# EAGLE schematic PickupDaughterBoard (EAGLE 7.4.0)
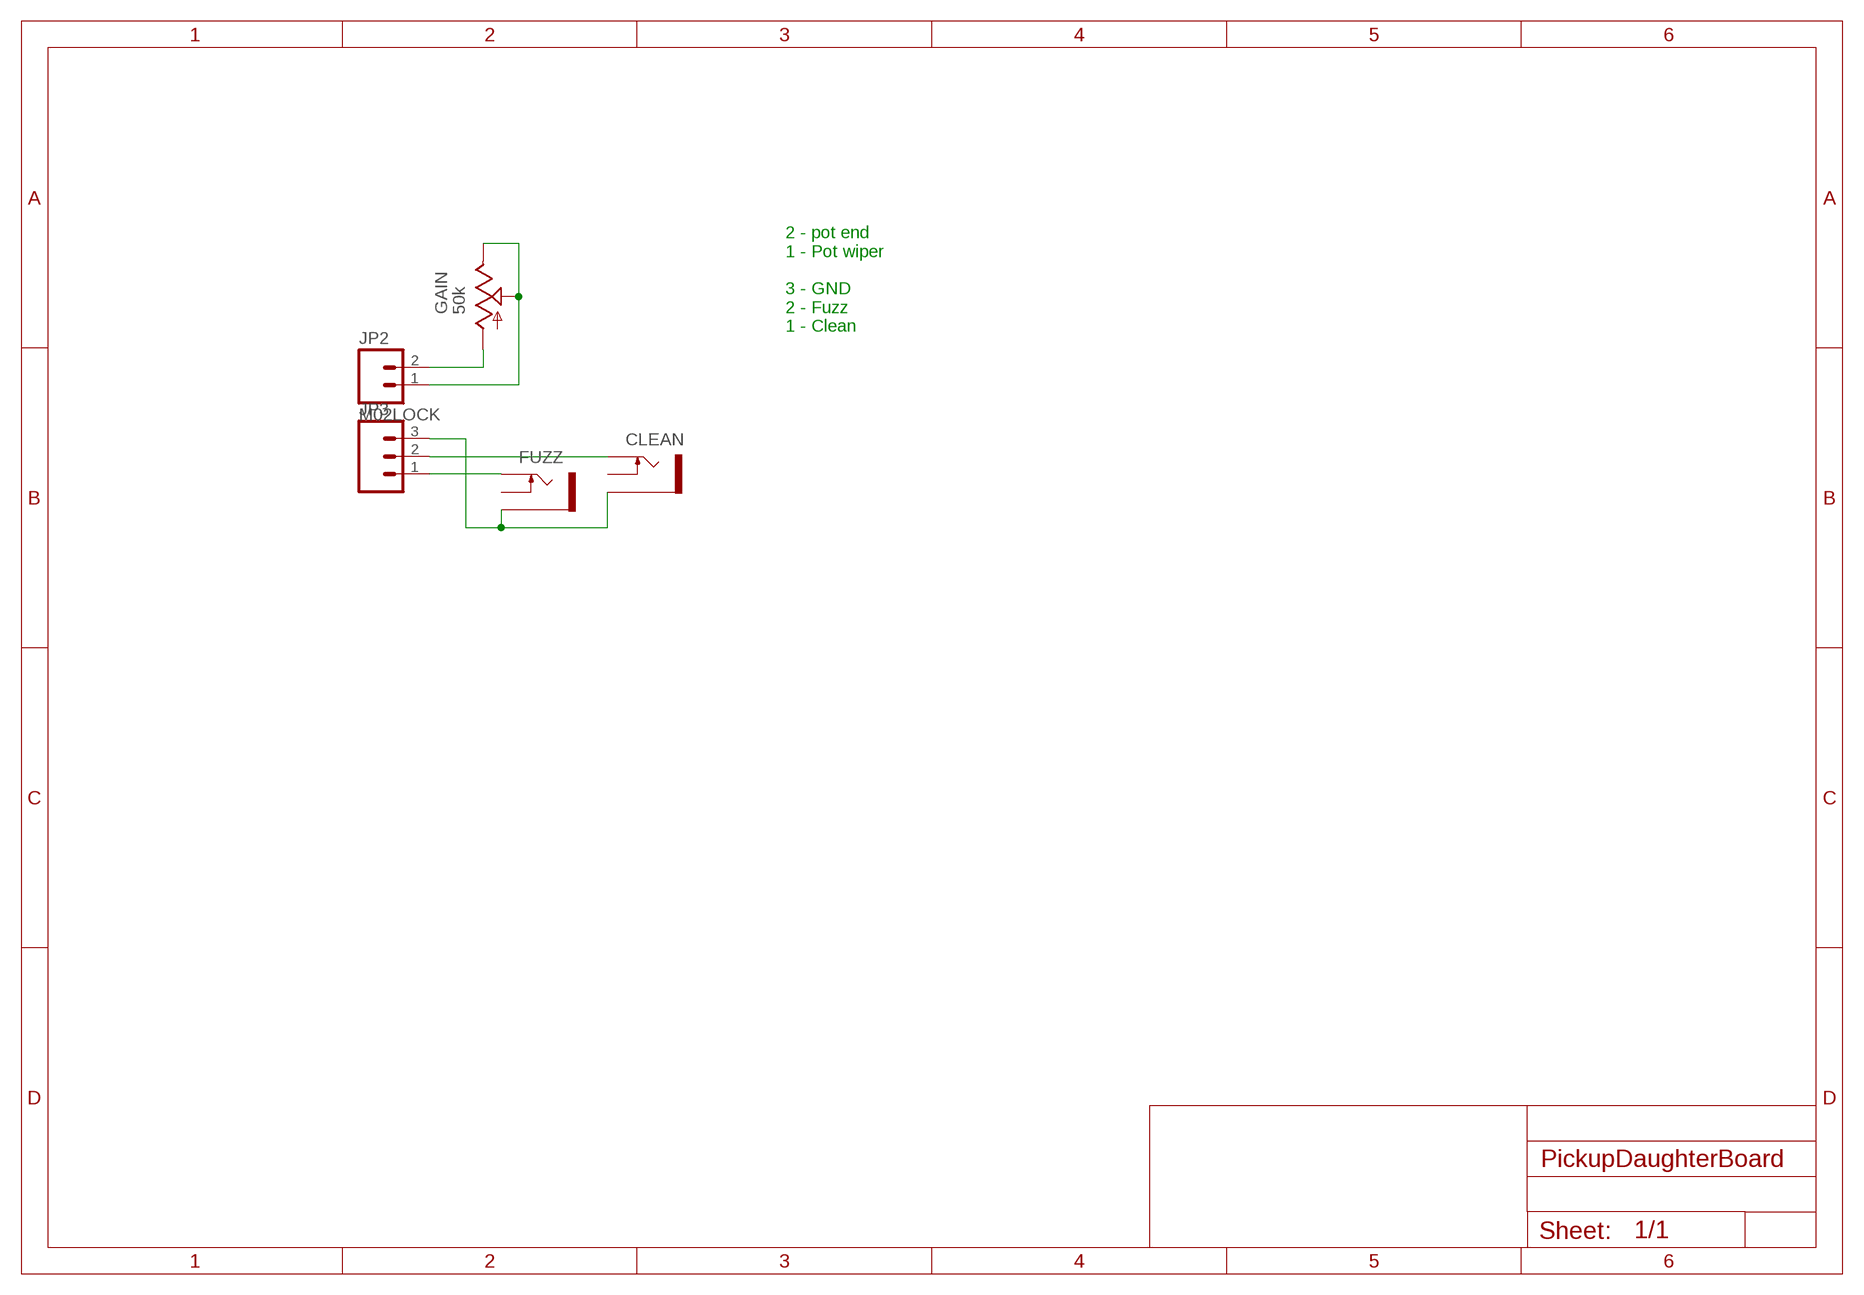
[diagram p0: schematic, sheet 1]

## Parts
CLEAN  THONKICONNNEW  [WQP-PJ301M-12_JACK]
FUZZ  THONKICONNNEW  [WQP-PJ301M-12_JACK]
GAIN  50k  ALPHA-9MMF2A  [EVUF]
JP2  M02LOCK  [1X02_LOCK]
JP3  M03LOCK  [1X03_LOCK]

## Nets
GND: CLEAN.P$3_SLEEVE(SLEEVE) FUZZ.P$3_SLEEVE(SLEEVE) JP3.3
N$1: FUZZ.P$1_TIP(TIP) JP3.1
N$2: CLEAN.P$1_TIP(TIP) JP3.2
N$4: GAIN.1(A) JP2.2
N$8: GAIN.2(S) GAIN.3(E) JP2.1
Unconnected: CLEAN.P$2_SWITCH(SWITCH) FUZZ.P$2_SWITCH(SWITCH)

## Notes on the sheet
- 2 - pot end
  1 - Pot wiper
  
  3 - GND
  2 - Fuzz
  1 - Clean

## Library data of the parts
CLEAN FUZZ = MusicThingModular:THONKICONN: 3.5mm socket for Eurorack modular synths
GAIN = TomW:ALPHA-9MM: 9 mm Square Rotary Potentiometers Source: Panasonic
JP2 = SparkFun-Connectors:M02: Standard 2-pin 0.1" header. Use with - straight break away headers ( PRT-00116) - right angle break away headers (PRT-00553) - swiss pins (PRT-00743) - machine pins (PRT-00117) - female headers (PRT-00115) Molex polarized connector foot print use with: PRT-08233 with associated crimp pins and housings. 2.54_SCREWTERM for use with PRT-10571. 3.5mm Screw Terminal footprints for PRT-08084 5mm Screw Terminal footprints for use with PRT-08433
JP3 = SparkFun-Connectors:M03: Header 3 Standard 3-pin 0.1" header. Use with straight break away headers (SKU : PRT-00116), right angle break away headers (PRT-00553), swiss pins (PRT-00743), machine pins (PRT-00117), and female headers (PRT-00115). Molex polarized connector foot print use with SKU : PRT-08232 with associated crimp pins and housings.

## Net classes
0 default: width 0.254 mm
1 power: width 0.406 mm
2 ground: width 0.406 mm